# Altium schematic sheet Block diagram.SchDoc: BLOCK DIAGRAM
size A4; ApprovedBy: José Báez; CheckedBy: José Báez; Author: José Báez; CompanyName: Onubense de Sistemas Cuatro-20 S.L.; DrawnBy: José Báez; Engineer: José Báez; Organization: Cuatro-20 Control Systems; Address1: C/ Islas Malvinas n.7; Address2: 21007 Huelva; Address3: Spain; DocumentNumber: 2; Revision: 0; SheetNumber: 2; SheetTotal: 7; CreatedDate: 25/09/2026
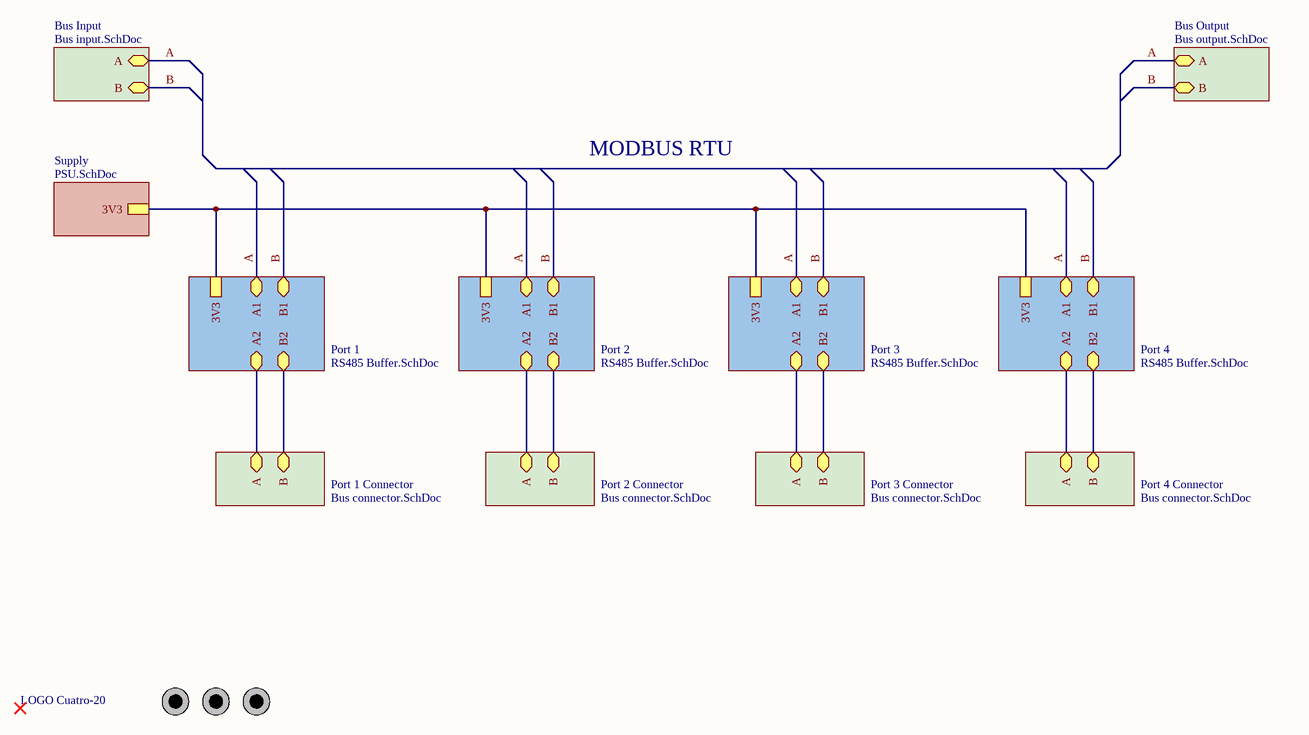
[diagram p0: Block diagram.SchDoc]

## Parts
FD1  Fiducial  [Fiducial 2mm]  (value not drawn)
FD2  Fiducial  [Fiducial 2mm]  (value not drawn)
FD3  Fiducial  [Fiducial 2mm]  (value not drawn)
Logo1  Cuatro-20  [Logo Cuatro-20]  (value not drawn)

## Sub-sheets
Bus Input = Bus input.SchDoc: A (bidir), B (bidir)
Bus Output = Bus output.SchDoc: A (bidir), B (bidir)
Port 1 = RS485 Buffer.SchDoc: 3V3, A1 (bidir), B1 (bidir), A2 (bidir), B2 (bidir)
Port 1 Connector = Bus connector.SchDoc: A (bidir), B (bidir)
Port 2 = RS485 Buffer.SchDoc: 3V3, A1 (bidir), B1 (bidir), A2 (bidir), B2 (bidir)
Port 2 Connector = Bus connector.SchDoc: A (bidir), B (bidir)
Port 3 = RS485 Buffer.SchDoc: 3V3, A1 (bidir), B1 (bidir), A2 (bidir), B2 (bidir)
Port 3 Connector = Bus connector.SchDoc: A (bidir), B (bidir)
Port 4 = RS485 Buffer.SchDoc: 3V3, A1 (bidir), B1 (bidir), A2 (bidir), B2 (bidir)
Port 4 Connector = Bus connector.SchDoc: A (bidir), B (bidir)
Supply = PSU.SchDoc: 3V3

## Nets
A: sheet Port 1/A1, sheet Port 2/A1, sheet Port 3/A1, sheet Port 4/A1, sheet Bus Input/A, sheet Bus Output/A
B: sheet Port 1/B1, sheet Port 2/B1, sheet Port 3/B1, sheet Port 4/B1, sheet Bus Input/B, sheet Bus Output/B
(unnamed): sheet Supply/3V3, sheet Port 1/3V3, sheet Port 2/3V3, sheet Port 3/3V3, sheet Port 4/3V3
(unnamed): sheet Port 1/A2, sheet Port 1 Connector/A
(unnamed): sheet Port 1/B2, sheet Port 1 Connector/B
(unnamed): sheet Port 2/A2, sheet Port 2 Connector/A
(unnamed): sheet Port 2/B2, sheet Port 2 Connector/B
(unnamed): sheet Port 3/A2, sheet Port 3 Connector/A
(unnamed): sheet Port 3/B2, sheet Port 3 Connector/B
(unnamed): sheet Port 4/A2, sheet Port 4 Connector/A
(unnamed): sheet Port 4/B2, sheet Port 4 Connector/B

## Notes on the sheet
- MODBUS RTU
- This document and the data disclosed herein is the property of Cuatro-20 Control Systems and may not be
- reproduced, used or disclosed in whole or in part without the express written permission of Innovative Industrial
- Design. All patent, proprietary, design, use, sale, manufacturing and reproduction rights are reserved by
- Cuatro-20 Control Systems.
- Project name:
- Sheet title:
- File name:
- Assembly variant:
- Author:
- Modified:
- Created:
- Revision:
- Size:
- A4
- Sheet
- Cuatro-20 Control Systems ™ <www.cuatro-20.com>
- of
- (in symbol Cuatro-20) LOGO Cuatro-20

## Library data of the parts
FD1-FD3 = Fiducial: Fiducial Mark
Logo1 = Cuatro-20: Cuatro-20 Logo